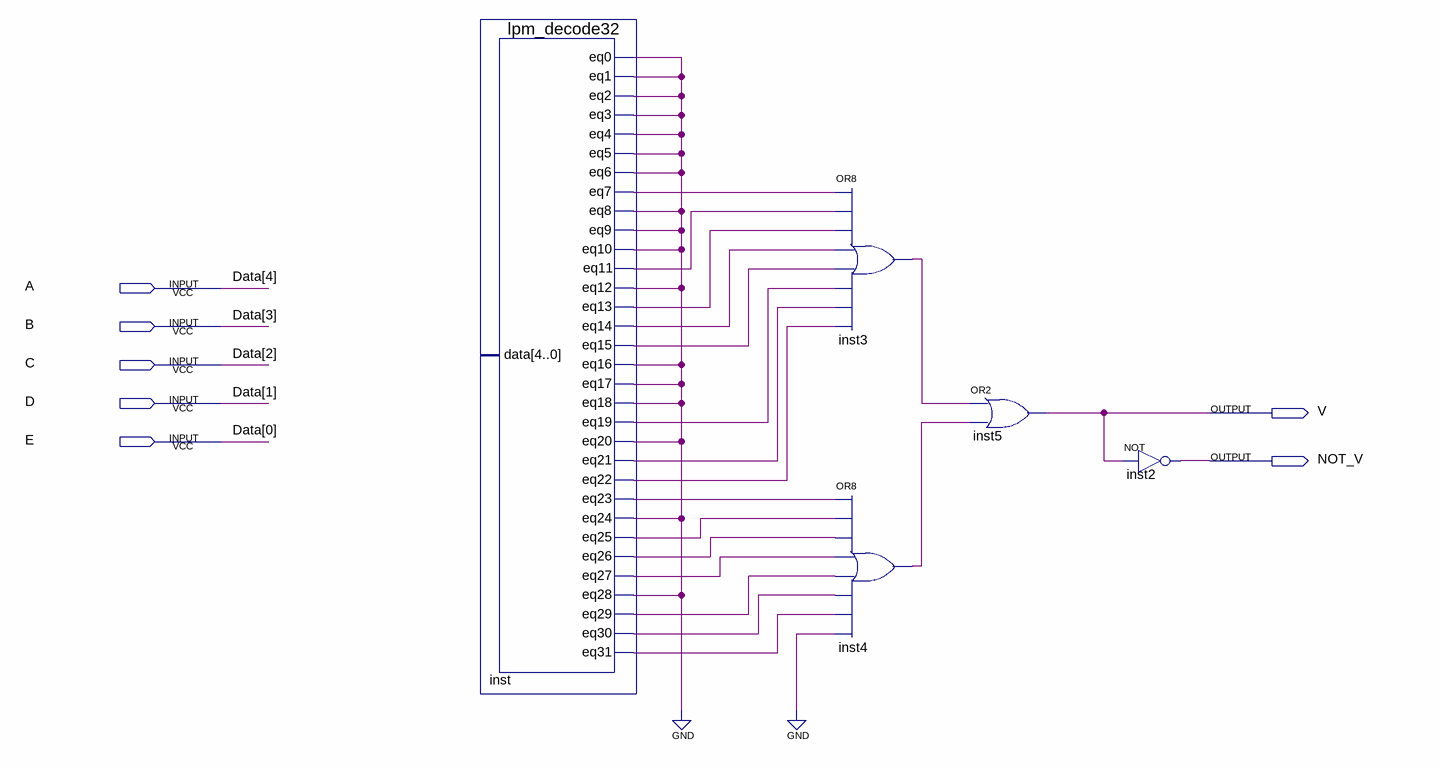
[diagram p0: schematic sheet]
// Quartus schematic devoir1_c3.bdf as structural Verilog: 5 symbols, 7 pins
module devoir1_c3 (
  input  A,
  input  B,
  input  C,
  input  D,
  input  E,
  output V,
  output NOT_V
);

  wire inst3_out, inst4_out, inst_eq0, inst_eq7, inst_eq11, inst_eq13, inst_eq14, inst_eq15, inst_eq19,
       inst_eq21, inst_eq22, inst_eq23, inst_eq25, inst_eq26, inst_eq27, inst_eq29, inst_eq30, inst_eq31;

  lpm_decode32 inst (
    .eq0(inst_eq0), .eq1(inst_eq0), .eq2(inst_eq0), .eq3(inst_eq0), .eq4(inst_eq0), .eq5(inst_eq0),
    .eq6(inst_eq0), .eq7(inst_eq7), .eq8(inst_eq0), .eq9(inst_eq0), .eq10(inst_eq0), .eq11(inst_eq11),
    .eq12(inst_eq0), .eq13(inst_eq13), .eq14(inst_eq14), .eq15(inst_eq15), .eq16(inst_eq0), .eq17(inst_eq0),
    .eq18(inst_eq0), .eq19(inst_eq19), .eq20(inst_eq0), .eq21(inst_eq21), .eq22(inst_eq22), .eq23(inst_eq23),
    .eq24(inst_eq0), .eq25(inst_eq25), .eq26(inst_eq26), .eq27(inst_eq27), .eq28(inst_eq0), .eq29(inst_eq29),
    .eq30(inst_eq30), .eq31(inst_eq31));  // open: data
  or inst3 (inst3_out, inst_eq7, inst_eq11, inst_eq13, inst_eq14, inst_eq15, inst_eq19, inst_eq21, inst_eq22);
  or inst4 (inst4_out, inst_eq23, inst_eq25, inst_eq26, inst_eq27, inst_eq29, inst_eq30, inst_eq31, 1'b0);
  or inst5 (V, inst3_out, inst4_out);
  not inst2 (NOT_V, V);
  // also tied to GND on the sheet: inst_eq0

  // Other names for the same wires on the sheet: Data[4:0] = {A, B, C, D, E}
endmodule
